# EAGLE schematic Teensy3_2_4IN:4OUTmcp4628 PANEL (EAGLE 9.5.1)

## Sheet 1 of 2: IO Conditioning
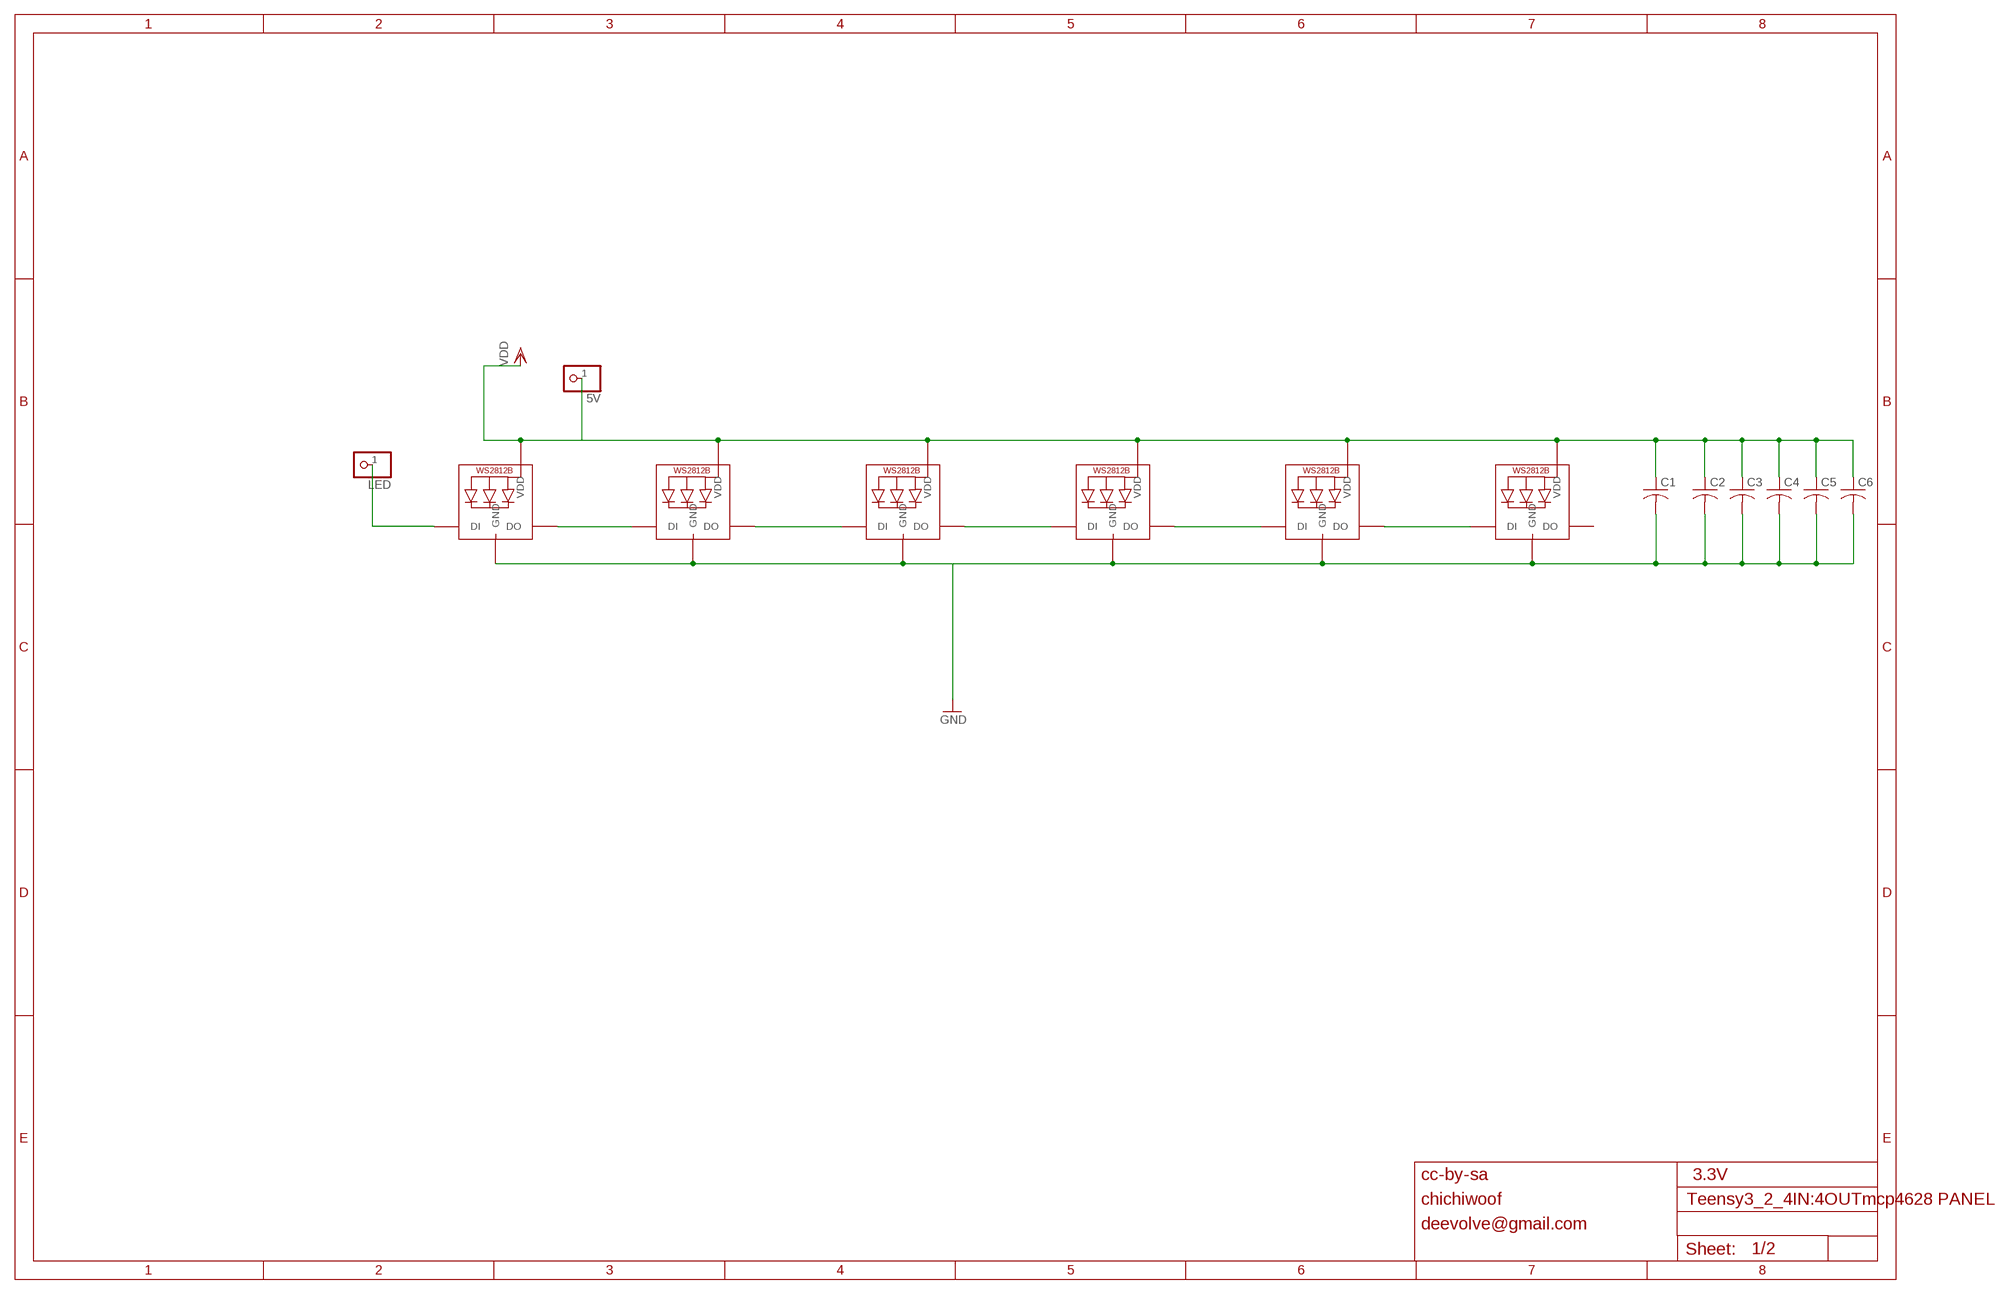
[diagram p0: schematic, sheet 1]

### Parts
5V  NEOPIXELRING_PINHD-1X1CB  [NEOPIXELRING_1X01-CLEANBIG]
C1  C-USC0603  [C0603]
C2  C-USC0603  [C0603]
C3  C-USC0603  [C0603]
C4  C-USC0603  [C0603]
C5  C-USC0603  [C0603]
C6  C-USC0603  [C0603]
LED  NEOPIXELRING_PINHD-1X1CB  [NEOPIXELRING_1X01-CLEANBIG]
LED1  WS2812B5050  [WS2812B]
LED2  WS2812B5050  [WS2812B]
LED3  WS2812B5050  [WS2812B]
LED4  WS2812B5050  [WS2812B]
LED5  WS2812B5050  [WS2812B]
LED7  WS2812B5050  [WS2812B]

### Nets
GND: C1.2 C2.2 C3.2 C4.2 C5.2 C6.2 LED1.3-GND(GND) LED2.3-GND(GND) LED3.3-GND(GND) LED4.3-GND(GND) LED5.3-GND(GND) LED7.3-GND(GND)
N$1: LED1.4-DIN(DI) LED7.2-DOUT(DO)
N$2: LED1.2-DOUT(DO) LED2.4-DIN(DI)
N$3: LED2.2-DOUT(DO) LED3.4-DIN(DI)
N$4: LED3.2-DOUT(DO) LED4.4-DIN(DI)
N$5: LED4.2-DOUT(DO) LED5.4-DIN(DI)
N$6: LED7.4-DIN(DI) LED.1
VDD: 5V.1 C1.1 C2.1 C3.1 C4.1 C5.1 C6.1 LED1.1-VDD(VDD) LED2.1-VDD(VDD) LED3.1-VDD(VDD) LED4.1-VDD(VDD) LED5.1-VDD(VDD) LED7.1-VDD(VDD)
Unconnected: LED5.2-DOUT(DO)

### Notes on the sheet
- cc-by-sa | 3.3V
- chichiwoof
- deevolve@gmail.com

## Sheet 2 of 2: Power and Arduino Pins
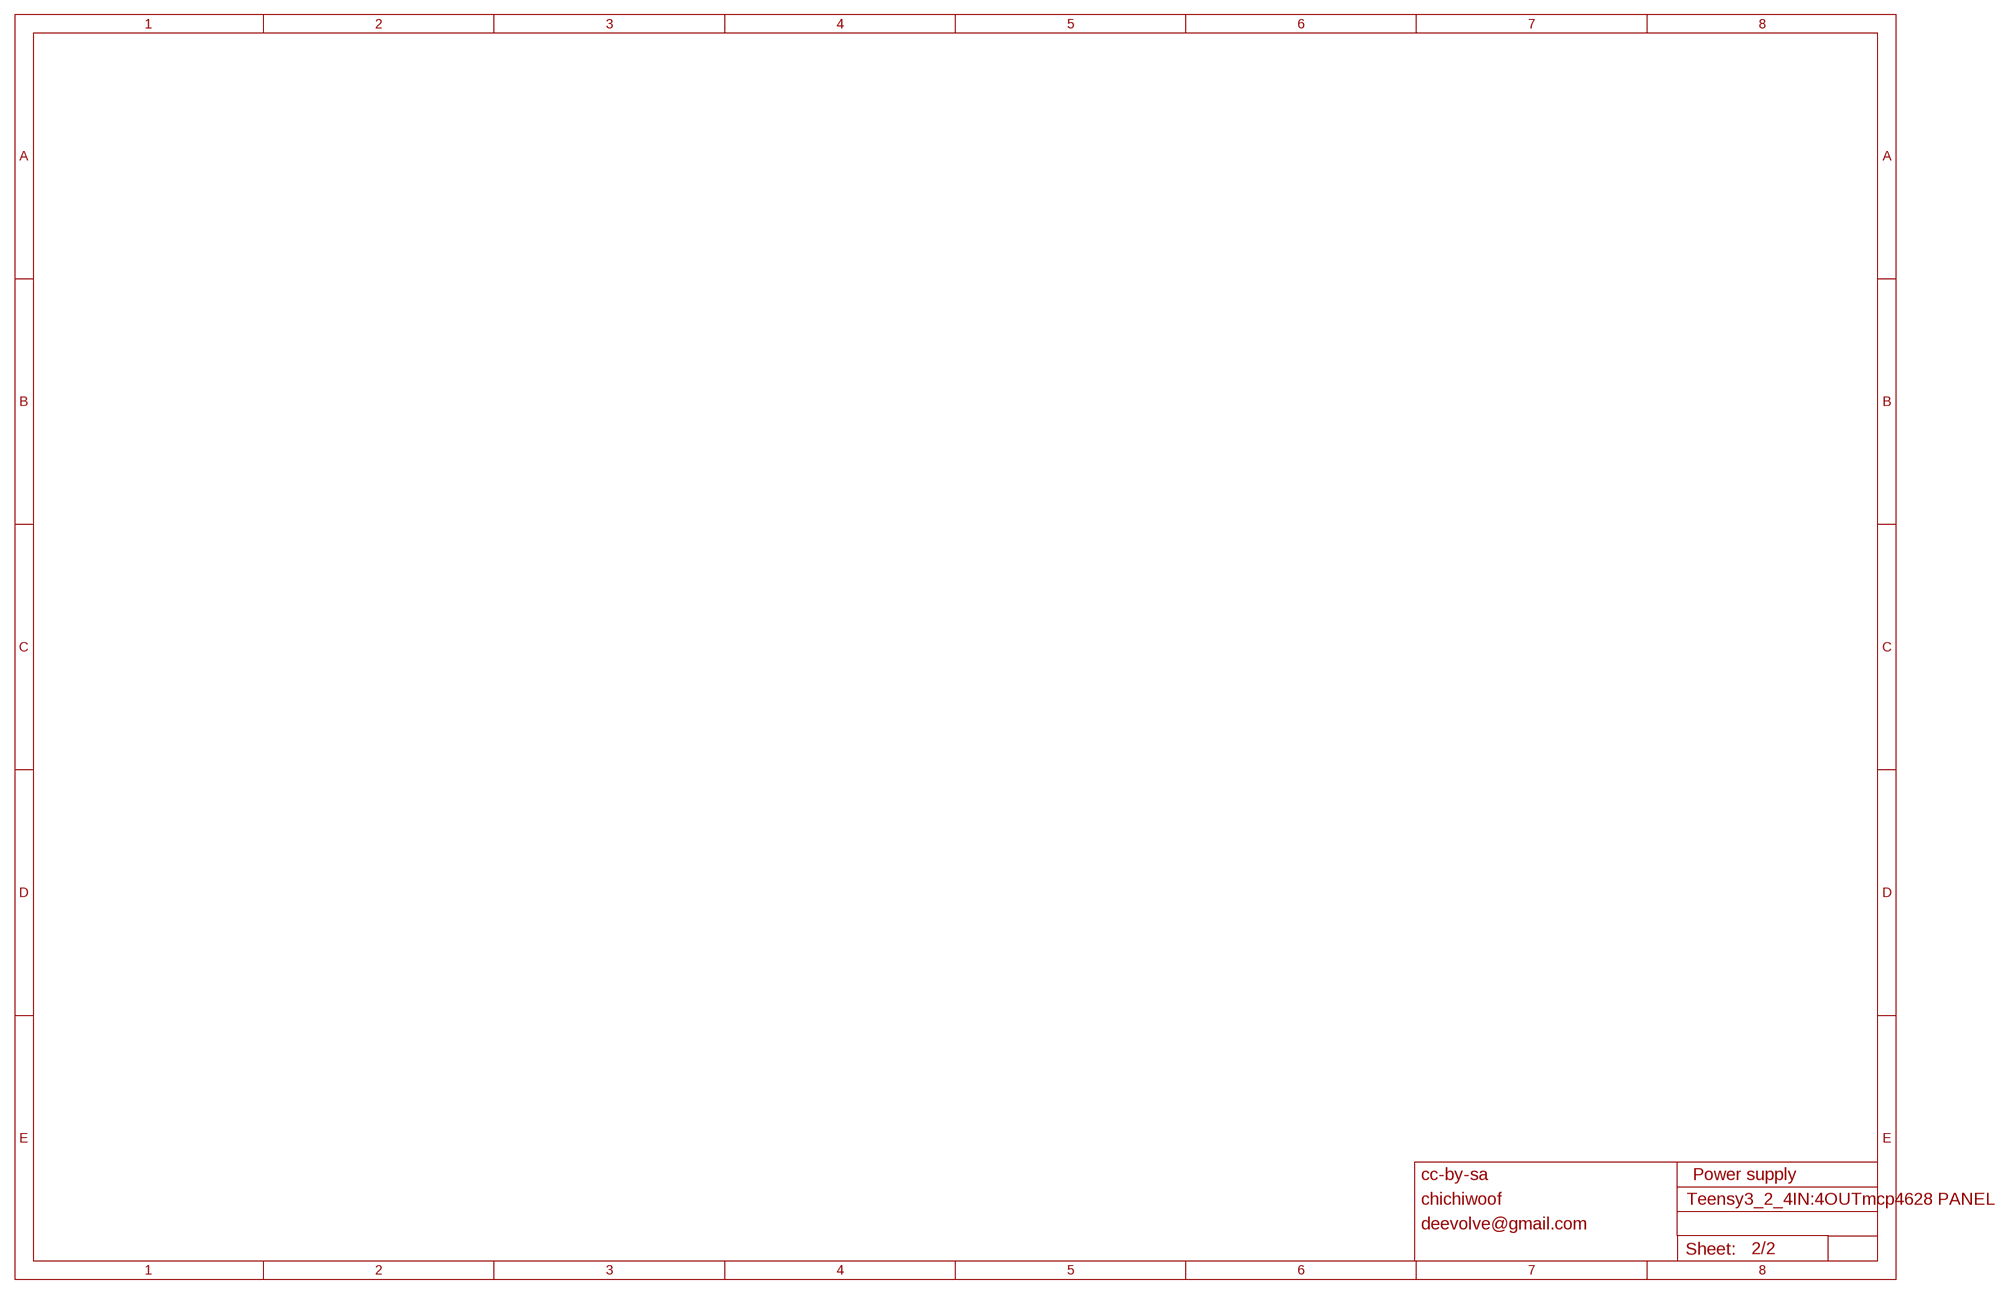
[diagram p1: schematic, sheet 2]

### Notes on the sheet
- cc-by-sa | Power supply
- chichiwoof
- deevolve@gmail.com

## Library data of the parts
5V LED = Adafruit NeoPixel Ring 12:NEOPIXELRING_PINHD-1X1: Pin header 1x1 for 0.1" spacing With round pins
C1-C6 = rcl:C-US: CAPACITOR, American symbol; SPICEPREFIX: C
LED1-LED5 LED7 = WS2812B:WS2812B; AVAILABILITY: Unavailable; DESCRIPTION: Raspberry Pi HAT _40 pin_ Wheeled Robotics Kit; MF: SparkFun Electronics; MP: WS2812B; PACKAGE: None; PRICE: None

## Net classes
0 default: width 0.254 mm, clearance 0.305 mm
1 GND: width 0.406 mm, clearance 0.254 mm to class 0, clearance 0.254 mm
2 +3V3: width 0.356 mm, clearance 0.152 mm to class 0, clearance 0.254 mm
3 -10V: width 0.356 mm, clearance 0.152 mm to class 0, clearance 0.254 mm
4 VCC: width 0.457 mm, clearance 0.152 mm to class 0, clearance 0.254 mm
5 VEE: width 0.457 mm, clearance 0.152 mm to class 0, clearance 0.254 mm